# Altium schematic sheet Ethernet.SchDoc
size A3; DocumentNumber: 4; SheetNumber: 4; SheetTotal: 6
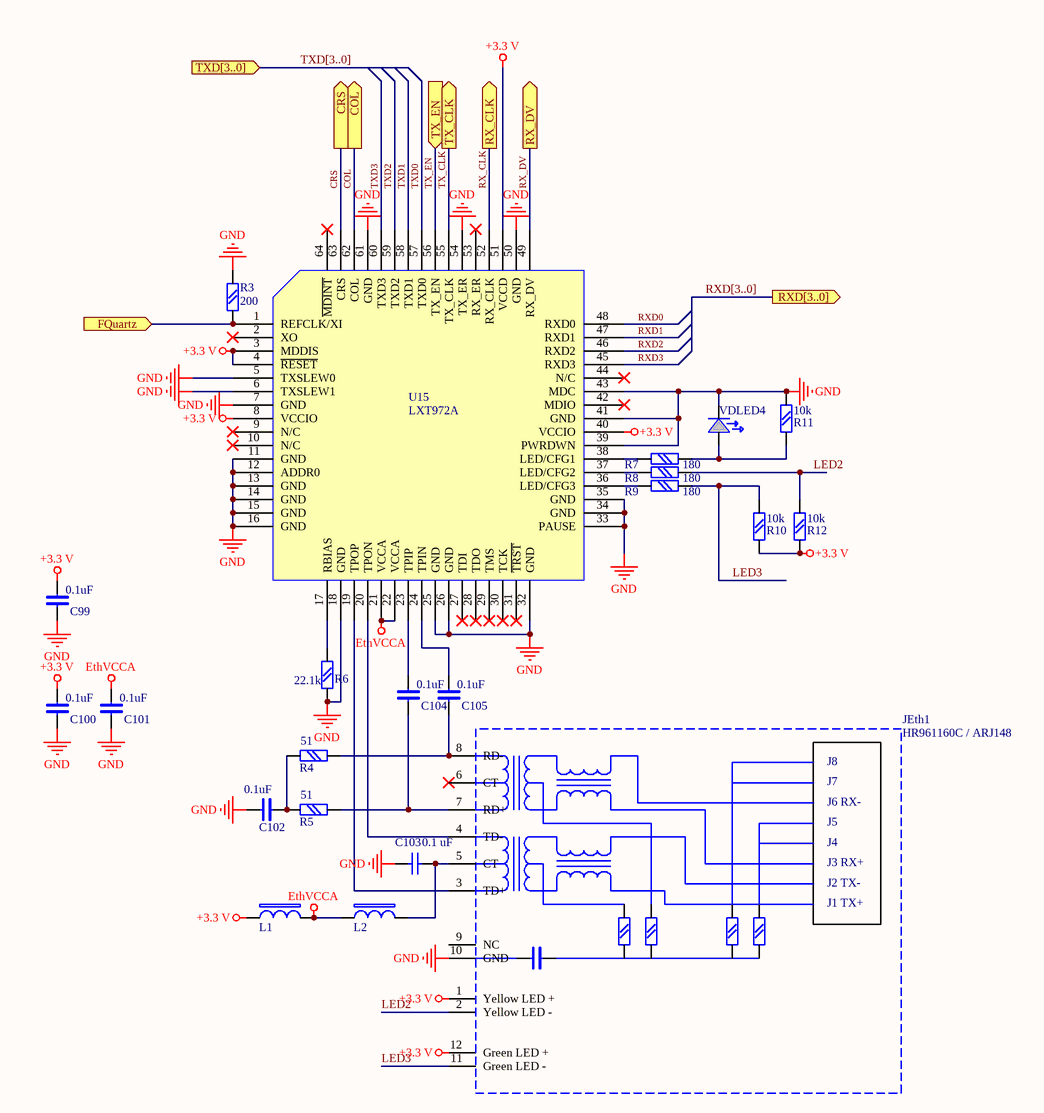
[diagram p0: Ethernet.SchDoc]

## Parts
C99  0.1uF  [chip0603]
C100  0.1uF  [chip0603]
C101  0.1uF  [chip0603]
C102  0.1uF  [chip0603]
C103  value 0.1 uF  [chip0603]  (hidden comment: 0.1uF)
C104  0.1uF  [chip0603]
C105  0.1uF  [chip0603]
JEth1  HR961160C / ARJ148  [HR961160C]
L1  DR  [chip0805]  (value not drawn)
L2  DR  [chip0805]  (value not drawn)
R3  200  [chip0603]
R4  51  [chip0603]
R5  51  [chip0603]
R6  22.1k  [chip0603]
R7  180  [chip0603]
R8  180  [chip0603]
R9  180  [chip0603]
R10  10k  [chip0603]
R11  10k  [chip0603]
R12  10k  [chip0603]
U15  LXT972A  [TQFP64]
VDLED4  LED  [LED2P5_H]  (value not drawn)

## Ports
COL (out), CRS (out), FQuartz (in), RX_CLK (out), RX_DV (out), RXD[3..0] (out), TX_CLK (out), TX_EN (in), TXD[3..0] (in)

## Nets
+3.3 V: C99.2 C100.2 JEth1.1(Yellow_LED_+) JEth1.12(Green_LED_+) L1.1 R10.1 R12.1 U15.3(MDDIS) U15.4(~{RESET}) U15.8(VCCIO) U15.40(VCCIO) U15.51(VCCD)
EthVCCA: C101.2 L1.2 L2.1 U15.21(VCCA) U15.22(VCCA)
GND: C99.1 C100.1 C101.1 C102.2 C103.1 JEth1.10(GND) R3.2 R6.2 R11.2 U15.5(TXSLEW0) U15.6(TXSLEW1) U15.7(GND) U15.11(GND) U15.12(ADDR0) U15.13(GND) U15.14(GND) U15.15(GND) U15.16(GND) U15.18(GND) U15.25(GND) U15.26(GND) U15.32(GND) U15.33(PAUSE) U15.34(GND) U15.35(GND) U15.39(PWRDWN) U15.41(GND) U15.43(MDC) U15.50(GND) U15.54(TX_ER) U15.61(GND) VDLED4.CATH
COL: U15.62(COL) ; port COL
CRS: U15.63(CRS) ; port CRS
FQuartz: R3.1 U15.1(REFCLK/XI) ; port FQuartz
LED2: JEth1.2(Yellow_LED_-) R8.2 R12.2
LED3: JEth1.11(Green_LED_-) R9.2 R10.2
RX_CLK: U15.52(RX_CLK) ; port RX_CLK
RX_DV: U15.49(RX_DV) ; port RX_DV
RXD0: U15.48(RXD0)
RXD1: U15.47(RXD1)
RXD2: U15.46(RXD2)
RXD3: U15.45(RXD3)
TX_CLK: U15.55(TX_CLK) ; port TX_CLK
TX_EN: U15.56(TX_EN) ; port TX_EN
TXD0: U15.57(TXD0)
TXD1: U15.58(TXD1)
TXD2: U15.59(TXD2)
TXD3: U15.60(TXD3)
NetC102_1: C102.1 R4.1 R5.2
NetC103_2: C103.2 JEth1.5(CT) L2.2
NetC104_1: C104.1 JEth1.7(RD+) R5.1
NetC104_2: C104.2 U15.23(TPIP)
NetC105_1: C105.1 JEth1.8(RD-) R4.2
NetC105_2: C105.2 U15.24(TPIN)
NetJEth1_3: JEth1.3(TD+) U15.19(TPOP)
NetJEth1_4: JEth1.4(TD-) U15.20(TPON)
NetR6_1: R6.1 U15.17(RBIAS)
NetR7_1: R7.1 U15.38(LED/CFG1)
NetR7_2: R7.2 R11.1 VDLED4.ANOD
NetR8_1: R8.1 U15.37(LED/CFG2)
NetR9_1: R9.1 U15.36(LED/CFG3)

Not connected (* = marked no-connect by the designer): JEth1 6(CT)* 9(NC); U15 2(XO)* 9(N/C)* 10(N/C)* 27(TDI)* 28(TDO)* 29(TMS)* 30(TCK)* 31(~{TRST})* 42(MDIO)* 44(N/C)* 53(RX_ER)* 64(~{MDINT})*

## Buses and harness runs
bus RXD[3..0] = port RXD[3..0]
bus TXD[3..0] = port TXD[3..0]

## Notes on the sheet
- (in symbol HR961160C) J8; J7; J6 RX-; J5; J4; J3 RX+; J2 TX-; J1 TX+

## Library data of the parts
C99-C102 C104 C105 = C: Text Field1: 20; Text Field2: 10
C103 = Cap: Capacitor; Published: 8-Jun-2000; LatestRevisionDate: 17-Jul-2002; LatestRevisionNote: Re-released for DXP Platform.; Publisher: Altium Limited
JEth1 = HR961160C
L1 L2 = L: Text Field1: 30; Text Field2: 10
R3-R12 = R: Text Field1: 20; Text Field2: 20
VDLED4 = AL307: Text Field1: 10; Text Field2: 30